# EAGLE design control (EAGLE 6.1)

## Sheet 1 of 3
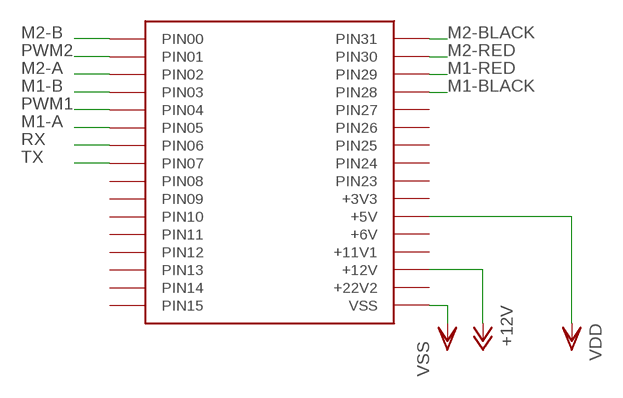
[diagram p0: schematic, sheet 1]

### Parts
U$1  BASE  [BASE]

### Nets
+12V: U$1.PIN18(+12V) ; also sheet 2
M1-A: U$1.PIN05 ; also sheet 2
M1-B: U$1.PIN03 ; also sheet 2
M1-BLACK: U$1.PIN28 ; also sheet 2
M1-RED: U$1.PIN29 ; also sheet 2
M2-A: U$1.PIN02 ; also sheet 2
M2-B: U$1.PIN00 ; also sheet 2
M2-BLACK: U$1.PIN31 ; also sheet 2
M2-RED: U$1.PIN30 ; also sheet 2
PWM1: U$1.PIN04 ; also sheet 2
PWM2: U$1.PIN01 ; also sheet 2
RX: U$1.PIN06 ; also sheet 3
TX: U$1.PIN07 ; also sheet 3
VDD: U$1.PIN21(+5V) ; also sheet 2,3
VSS: U$1.PIN16(VSS) ; also sheet 2,3
Unconnected: U$1.PIN08 U$1.PIN09 U$1.PIN10 U$1.PIN11 U$1.PIN12 U$1.PIN13 U$1.PIN14 U$1.PIN15 U$1.PIN17(+22V2) U$1.PIN19(+11V1) U$1.PIN20(+6V) U$1.PIN22(+3V3) U$1.PIN23 U$1.PIN24 U$1.PIN25 U$1.PIN26 U$1.PIN27

## Sheet 2 of 3
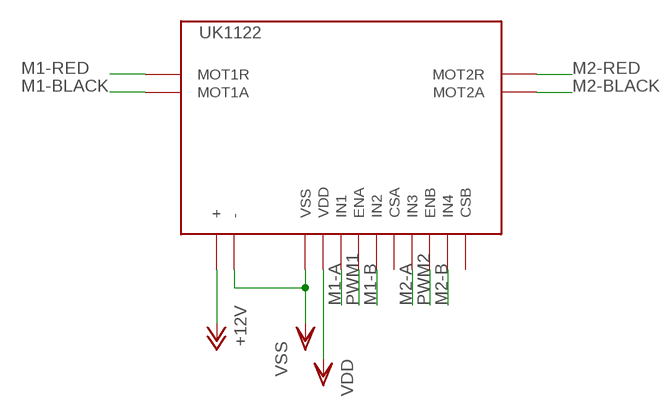
[diagram p1: schematic, sheet 2]

### Parts
UK1122  UK1122  [UK1122]

### Nets
+12V: UK1122.+ ; also sheet 1
M1-A: UK1122.IN1 ; also sheet 1
M1-B: UK1122.EN2(IN2) ; also sheet 1
M1-BLACK: UK1122.MOT1A ; also sheet 1
M1-RED: UK1122.MOT1R ; also sheet 1
M2-A: UK1122.IN3 ; also sheet 1
M2-B: UK1122.IN4 ; also sheet 1
M2-BLACK: UK1122.MOT2A ; also sheet 1
M2-RED: UK1122.MOT2R ; also sheet 1
PWM1: UK1122.ENA ; also sheet 1
PWM2: UK1122.ENB ; also sheet 1
VDD: UK1122.+5(VDD) ; also sheet 1,3
VSS: UK1122.- UK1122.GND(VSS) ; also sheet 1,3
Unconnected: UK1122.CSA UK1122.CSB

## Sheet 3 of 3
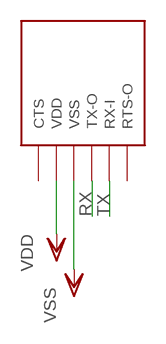
[diagram p2: schematic, sheet 3]

### Parts
U$3  BLUESMIRF  [BLUESMIRF]

### Nets
RX: U$3.TX-O ; also sheet 1
TX: U$3.RX-I ; also sheet 1
VDD: U$3.VDD ; also sheet 1,2
VSS: U$3.VSS ; also sheet 1,2
Unconnected: U$3.CTS-I(CTS) U$3.RTS-O

## Library data of the parts
U$1 = aasanchez:BASE
U$3 = aasanchez:BLUESMIRF
UK1122 = aasanchez:UK1122

## Board
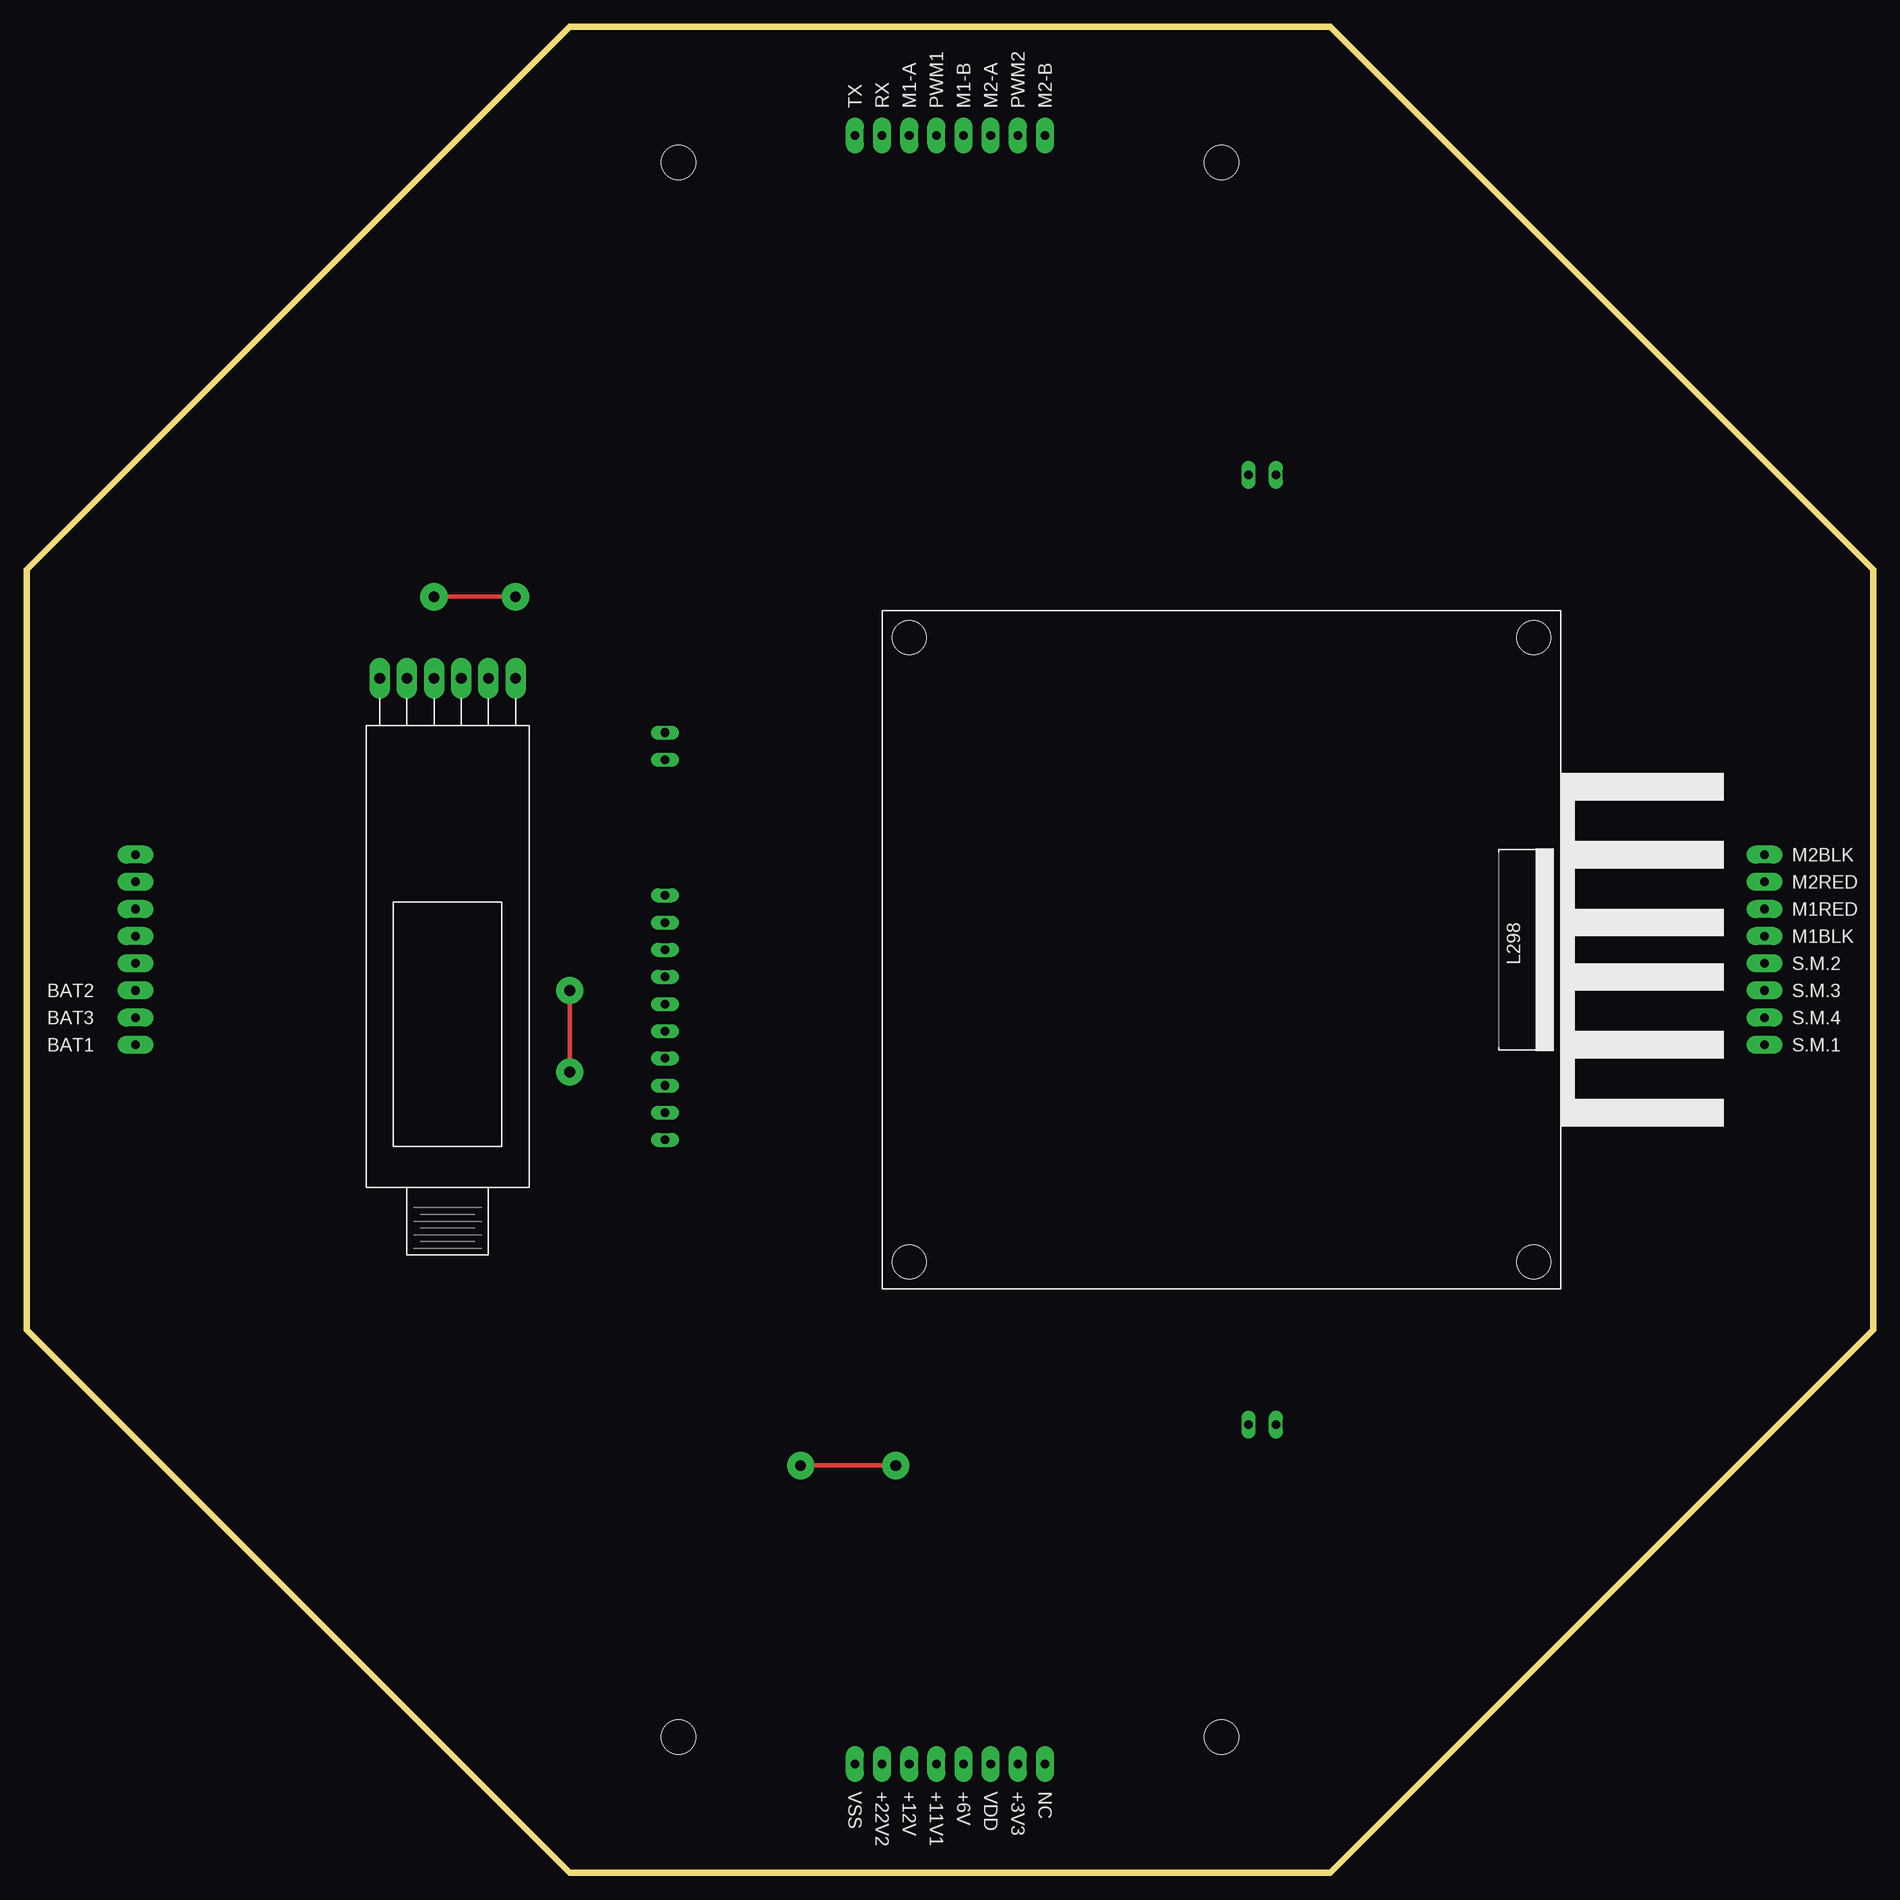
[diagram p3: board, top side]
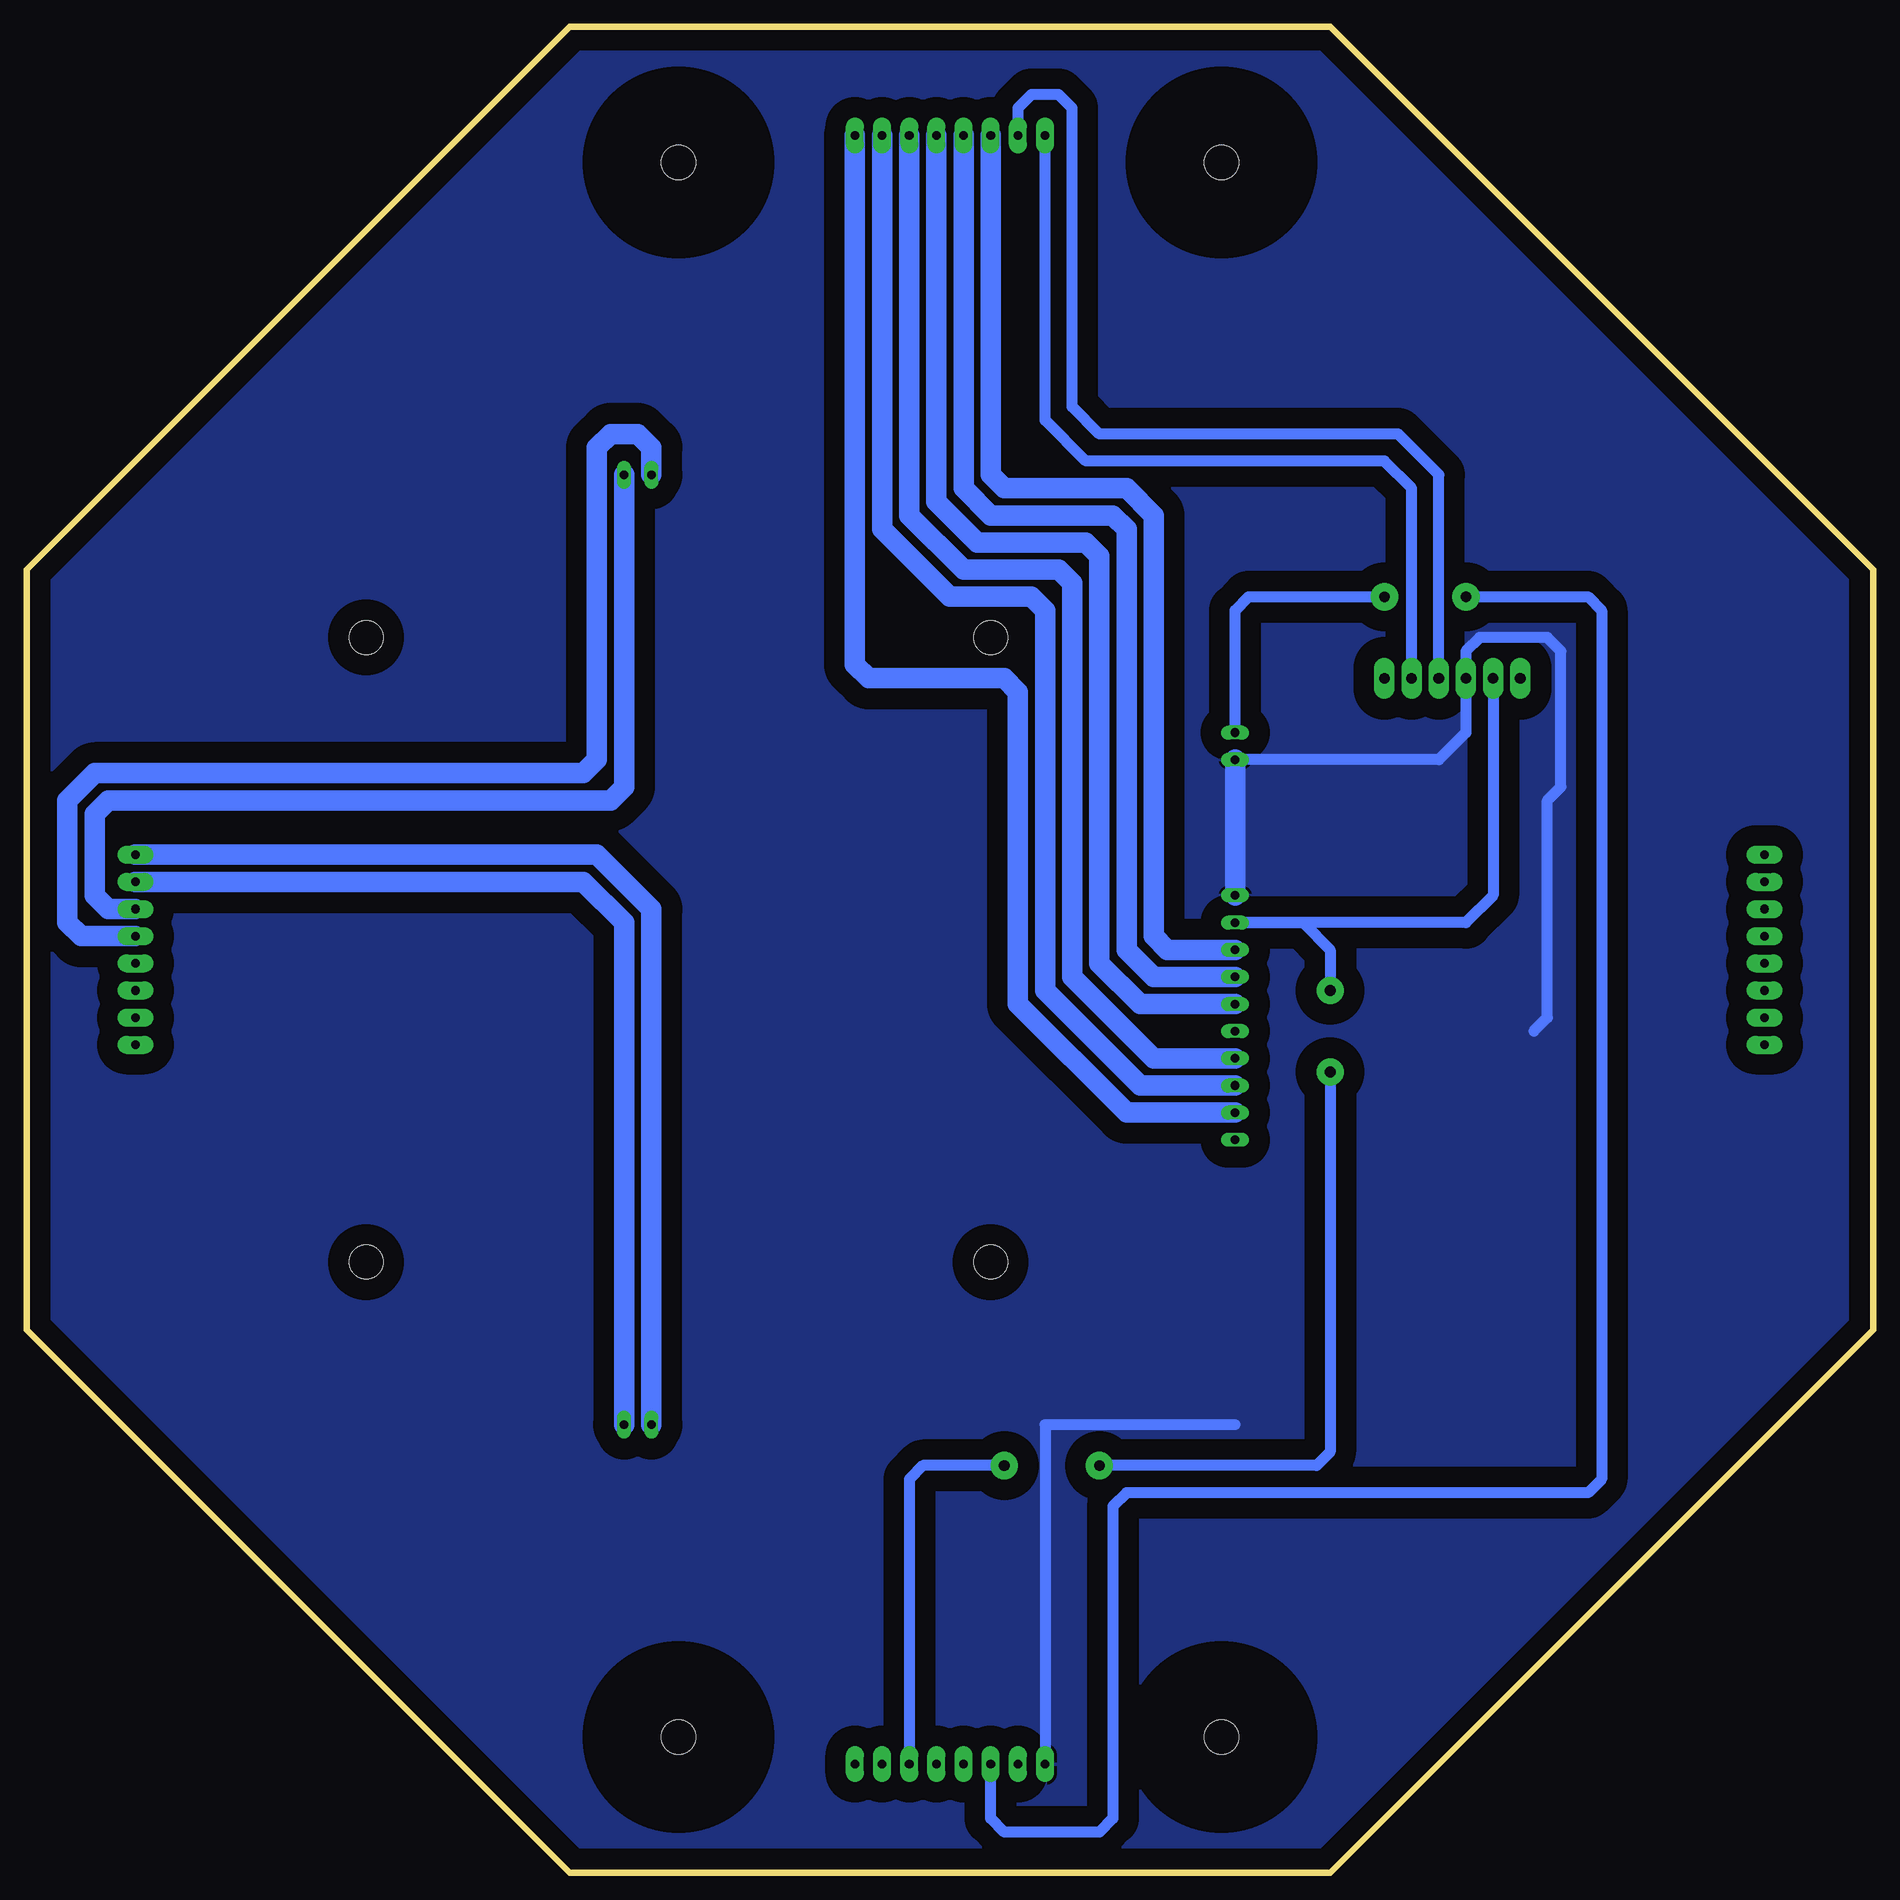
[diagram p4: board, bottom side, seen from below]

Size 172.72 x 172.72 mm. Coordinates in mm from the lower left corner, seen from the top.
Copper layers (1*16): Top 0.035mm / dielectric 1.5mm / Bottom 0.035mm
Design rules: minimum track width 10mil, minimum drill 24mil, track to track 8mil, track to pad 8mil, pad to pad 8mil, via to via 8mil, smd to smd 8mil, copper to edge 40mil, drill to drill 8mil, minimum pad ring 10mil, minimum via ring 8mil, stop-mask expansion 4mil, vias tented up to drill 0mil, thermal gap 10mil

### Footprints (pad centres in the part's own frame; a part is rotated, then mirrored left to right if it is on the bottom)
BASE = drill 0.8 pad 1.676 long: PIN00 8.89,76.2; PIN01 6.35,76.2; PIN02 3.81,76.2; PIN03 1.27,76.2; PIN04 -1.27,76.2; PIN05 -3.81,76.2; PIN06 -6.35,76.2; PIN07 -8.89,76.2; PIN08 -76.2,8.89; PIN09 -76.2,6.35; PIN10 -76.2,3.81; PIN11 -76.2,1.27; PIN12 -76.2,-1.27; PIN13 -76.2,-3.81; PIN14 -76.2,-6.35; PIN15 -76.2,-8.89; PIN16 -8.89,-76.2; PIN17 -6.35,-76.2; PIN18 -3.81,-76.2; PIN19 -1.27,-76.2; PIN20 1.27,-76.2; PIN21 3.81,-76.2; PIN22 6.35,-76.2; PIN23 8.89,-76.2; PIN24 76.2,-8.89; PIN25 76.2,-6.35; PIN26 76.2,-3.81; PIN27 76.2,-1.27; PIN28 76.2,1.27; PIN29 76.2,3.81; PIN30 76.2,6.35; PIN31 76.2,8.89 | hole 3.2: -25.4,73.66; 25.4,73.66; -25.4,-73.66; 25.4,-73.66
BLUESMIRF = drill 1 pad 1.93 long: CTS-I 0,0; RTS-O 0,12.7; RX-I 0,10.16; TX-O 0,7.62; VDD 0,2.54; VSS 0,5.08
UK1122 = drill 0.8 long: + 11.43,-20.32; +5 29.21,-20.32; - 13.97,-20.32; CSA 39.37,-20.32; CSB 49.53,-20.32; EN2 36.83,-20.32; ENA 34.29,-20.32; ENB 44.45,-20.32; GND 26.67,-20.32; IN1 31.75,-20.32; IN3 41.91,-20.32; IN4 46.99,-20.32; MOT1A -12.7,34.29; MOT1R -12.7,36.83; MOT2A 76.2,34.29; MOT2R 76.2,36.83 | hole 3.2: 2.54,60.96; 60.96,60.96; 2.54,2.54; 60.96,2.54

### Placement (x,y rotation side)
U$1  86.36,86.36 0 top
U$3  33.02,111.76 270 top
UK1122  80.01,118.11 270 top

### Tracks (layer width: path | path; a pad name or v marks a point on that pad's centre or on a via)
+12V  (via drill 1 pad 2.54)
  Top 0.406: v45.72,119.38 v38.1,119.38
  Bottom 1.016: v45.72,119.38 58.42,119.38 59.69,118.11 UK1122.+ | v38.1,119.38 26.67,119.38 25.4,118.11 25.4,36.83 26.67,35.56 69.85,35.56 71.12,34.29 71.12,5.08 72.39,3.81 81.28,3.81 82.55,5.08 U$1.PIN18
M1-A
  Bottom 1.93: UK1122.IN1 66.04,86.36 67.31,87.63 67.31,127 69.85,129.54 81.28,129.54 82.55,130.81 U$1.PIN05
M1-B
  Bottom 1.93: UK1122.EN2 68.58,81.28 72.39,85.09 72.39,123.19 73.66,124.46 83.82,124.46 87.63,128.27 U$1.PIN03
M1-BLACK
  Bottom 1.93: UK1122.MOT1A 114.3,133.35 115.57,134.62 118.11,134.62 119.38,133.35 119.38,104.14 120.65,102.87 166.37,102.87 168.91,100.33 168.91,88.9 167.64,87.63 U$1.PIN28
M1-RED
  Bottom 1.93: U$1.PIN29 165.1,90.17 166.37,91.44 166.37,99.06 165.1,100.33 118.11,100.33 116.84,101.6 UK1122.MOT1R
M2-A
  Bottom 1.93: U$1.PIN02 90.17,127 85.09,121.92 76.2,121.92 74.93,120.65 74.93,83.82 67.31,76.2 UK1122.IN3
M2-B
  Bottom 1.93: U$1.PIN00 95.25,113.03 93.98,111.76 81.28,111.76 80.01,110.49 80.01,81.28 69.85,71.12 UK1122.IN4
M2-BLACK
  Bottom 1.93: UK1122.MOT2A 114.3,90.17 119.38,95.25 U$1.PIN31
M2-RED
  Bottom 1.93: U$1.PIN30 120.65,92.71 116.84,88.9 UK1122.MOT2R
PWM1
  Bottom 1.93: U$1.PIN04 85.09,129.54 82.55,127 71.12,127 69.85,125.73 69.85,86.36 67.31,83.82 UK1122.ENA
PWM2
  Bottom 1.93: UK1122.ENB 68.58,73.66 77.47,82.55 77.47,118.11 78.74,119.38 86.36,119.38 92.71,125.73 U$1.PIN01
RX
  Bottom 1.016: U$3.TX-O 40.64,130.81 44.45,134.62 72.39,134.62 74.93,137.16 74.93,165.1 76.2,166.37 78.74,166.37 80.01,165.1 U$1.PIN06
TX
  Bottom 1.016: U$3.RX-I 43.18,129.54 45.72,132.08 73.66,132.08 77.47,135.89 U$1.PIN07
VDD  (via drill 1 pad 2.54)
  Top 0.406: v50.8,82.55 v50.8,74.93 | v72.39,38.1 v81.28,38.1
  Bottom 1.016: U$3.VDD 35.56,91.44 38.1,88.9 UK1122.+5 53.34,88.9 50.8,86.36 v50.8,82.55 | v50.8,74.93 50.8,39.37 52.07,38.1 v72.39,38.1 | v81.28,38.1 88.9,38.1 90.17,36.83 U$1.PIN21
VSS
  Bottom 1.016: UK1122.- 40.64,104.14 38.1,106.68 U$3.VSS 38.1,114.3 36.83,115.57 30.48,115.57 29.21,114.3 29.21,101.6 30.48,100.33 30.48,80.01 31.75,78.74 | 59.69,41.91 77.47,41.91 U$1.PIN16
  Bottom 1.93: UK1122.GND UK1122.-
  pour Bottom (isolate 1.93): 50.8,0 121.92,0 172.72,50.8 172.72,121.92 121.92,172.72 50.8,172.72 0,121.92 0,50.8